# EAGLE design Master_G2553 (EAGLE 6.5.0)
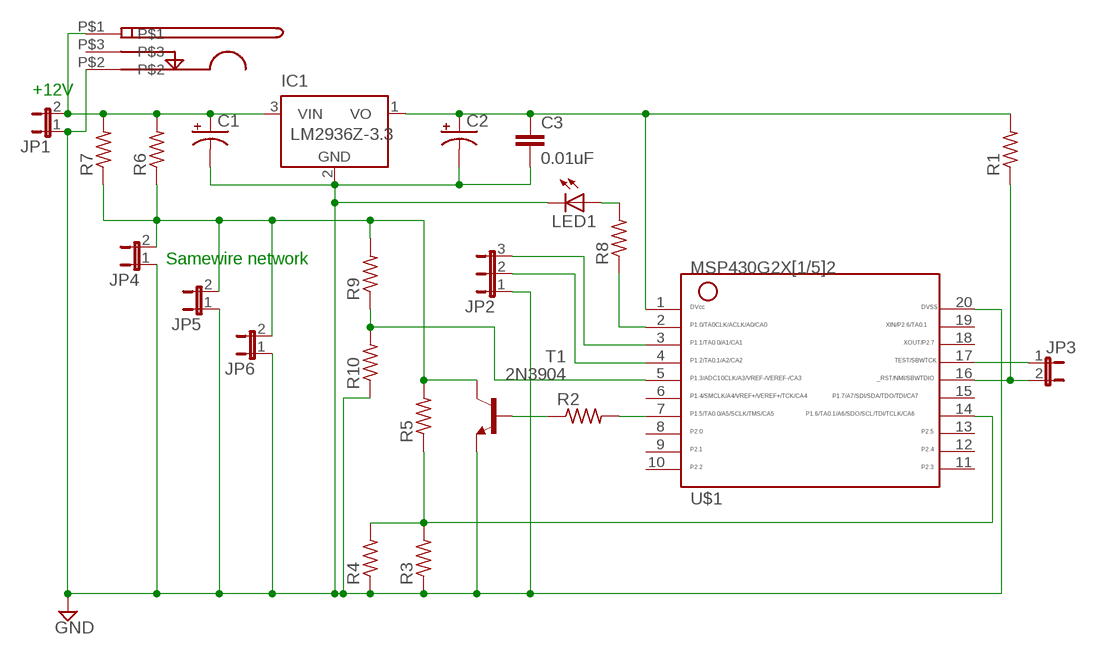
[diagram p0: schematic, sheet 1]

## Parts
C1  CPOL-USE2.5-6  [E2,5-6]
C2  CPOL-USE2.5-6  [E2,5-6]
C3  0.01uF  C7.5/3  [C7.5B3]
IC1  LM2936Z-3.3  [TO92]
JP1  JP1E  [JP1]
JP2  JP2E  [JP2]
JP3  JP1E  [JP1]
JP4  JP1E  [JP1]
JP5  JP1E  [JP1]
JP6  JP1E  [JP1]
LED1  LED3MM  [LED3MM]
R1  R-US_0204/2V  [0204V]
R2  R-US_0204/2V  [0204V]
R3  R-US_0204/2V  [0204V]
R4  R-US_0204/2V  [0204V]
R5  R-US_0204/2V  [0204V]
R6  R-US_0204/2V  [0204V]
R7  R-US_0204/2V  [0204V]
R8  R-US_0204/2V  [0204V]
R9  R-US_0204/2V  [0204V]
R10  R-US_0204/2V  [0204V]
T1  2N3904  [TO92]
U$1  G2X[1/5]2---N20  [N20]
U$2  2.1MM_5.5MM  [2.1MM_5.5MM]

## Nets
GND: C1.- C2.- C3.2 IC1.2(GND) JP1.1 JP2.1 JP4.1 JP5.1 JP6.1 LED1.K(C) R3.1 R4.1 R10.1 T1.3(E) U$1.20 U$2.P$2
N$1: JP2.2 U$1.4
N$2: R2.1 T1.2(B)
N$3 [pwr]: C1.+ IC1.3(VIN) JP1.2 R6.2 R7.2 U$2.P$1
N$4 [samewire]: JP4.2 JP5.2 JP6.2 R5.2 R6.1 R7.1 R9.2 T1.1(C)
N$5: R3.2 R4.2 R5.1 U$1.14
N$6: JP2.3 U$1.3
N$7: JP3.1 U$1.17
N$8: R2.2 U$1.7
N$9 [pwr]: C2.+ C3.1 IC1.1(VO) R1.2 U$1.1
N$10: LED1.A R8.2
N$11: R9.1 R10.2 U$1.5
N$12: R8.1 U$1.2
N$20: JP3.2 R1.1 U$1.16
Unconnected: U$1.6 U$1.8 U$1.9 U$1.10 U$1.11 U$1.12 U$1.13 U$1.15 U$1.18 U$1.19 U$2.P$3

## Notes on the sheet
- +12V
- Samewire network

## Library data of the parts
C1 C2 = rcl:CPOL-US: POLARIZED CAPACITOR, American symbol
C3 = capacitor-wima:C: CAPACITOR naming: grid - package width
IC1 = national-semiconductor:LM2936?*: Ultra-Low Quiescent Current LDO Voltage Regulator Source: Data sheet <http://www.national.com/ds/LM/LM2936.pdf>; MF: NATIONAL SEMICONDUCTOR; MPN: LM2936Z-3.3/NOPB; OC_FARNELL: 1564641; OC_NEWARK: 41K4532
JP1 JP3-JP6 = jumper:JP1E: JUMPER
JP2 = jumper:JP2E: JUMPER
LED1 = led:LED: LED OSRAM: - CHIPLED LG R971, LG N971, LY N971, LG Q971, LY Q971, LO R971, LY R971 LH N974, LH R974 LS Q976, LO Q976, LY Q976 LO Q996 - Hyper CHIPLED LW Q18S LB Q993, LB Q99A, LB R99A - SideLED LS A670, LO A670, LY A670, LG A670, LP A670 LB A673, LV A673, LT A673, LW A673 LH A674 LY A675 LS A676, LA A676, LO A676, LY A676, LW A676 LS A679, LY A679, LG A679 - Hyper Micro SIDELED® LS Y876, LA Y876, LO Y876, LY Y876 LT Y87S - SmartLED LW L88C, LW L88S LB L89C, LB L89S, LG L890 LS L89K, LO L89K, LY L89K LS L896, LA L896, LO L896, LY L896 - TOPLED LS T670, LO T670, LY T670, LG T670, LP T670 LSG T670, LSP T670, LSY T670, LOP T670, LYG T670 LG T671, LOG T671, LSG T671 LB T673, LV T673, LT T673, LW T673 LH T674 LS T676, LA T676, LO T676, LY T676, LB T676, LH T676, LSB T676, LW T676 LB T67C, LV T67C, LT T67C, LS T67K, LO T67K, LY T67K, LW E67C LS E67B, LA E67B, LO E67B, LY E67B, LB E67C, LV E67C, LT E67C LW T67C LS T679, LY T679, LG T679 LS T770, LO T770, LY T770, LG T770, LP T770 LB T773, LV T773, LT T773, LW T773 LH T774 LS E675, LA E675, LY E675, LS T675 LS T776, LA T776, LO T776, LY T776, LB T776 LHGB T686 LT T68C, LB T68C - Hyper Mini TOPLED® LB M676 - Mini TOPLED Santana® LG M470 LS M47K, LO M47K, LY M47K Source: http://www.osram.convergy.de LUXEON: - LUMILED® LXK2-PW12-R00, LXK2-PW12-S00, LXK2-PW14-U00, LXK2-PW14-V00 LXK2-PM12-R00, LXK2-PM12-S00, LXK2-PM14-U00 LXK2-PE12-Q00, LXK2-PE12-R00, LXK2-PE12-S00, LXK2-PE14-T00, LXK2-PE14-U00 LXK2-PB12-K00, LXK2-PB12-L00, LXK2-PB12-M00, LXK2-PB14-N00, LXK2-PB14-P00, LXK2-PB14-Q00 LXK2-PR12-L00, LXK2-PR12-M00, LXK2-PR14-Q00, LXK2-PR14-R00 LXK2-PD12-Q00, LXK2-PD12-R00, LXK2-PD12-S00 LXK2-PH12-R00, LXK2-PH12-S00 LXK2-PL12-P00, LXK2-PL12-Q00, LXK2-PL12-R00 Source: www.luxeon.com KINGBRIGHT: KA-3528ASYC Source: www.kingbright.com
R1-R10 = rcl:R-US_: RESISTOR, American symbol
T1 = transistor:2N3904: NPN TRANSISTOR
U$1 = TI_MSP430_v16:G2X[1/5]2---N20: MSP430G2X[1/5]2 MSP430G2x52, MSP430G2x12 PDIP (N) 20 Pin Package http://focus.ti.com/docs/prod/folders/print/msp430g2452.html
U$2 = CUI_PwrJack:2.1MM_5.5MM: CUI Connector Power Jack 2.1mm x 5.5mm

## Net classes
1 pwr: width 0.508 mm
2 samewire: width 0.508 mm

## Board
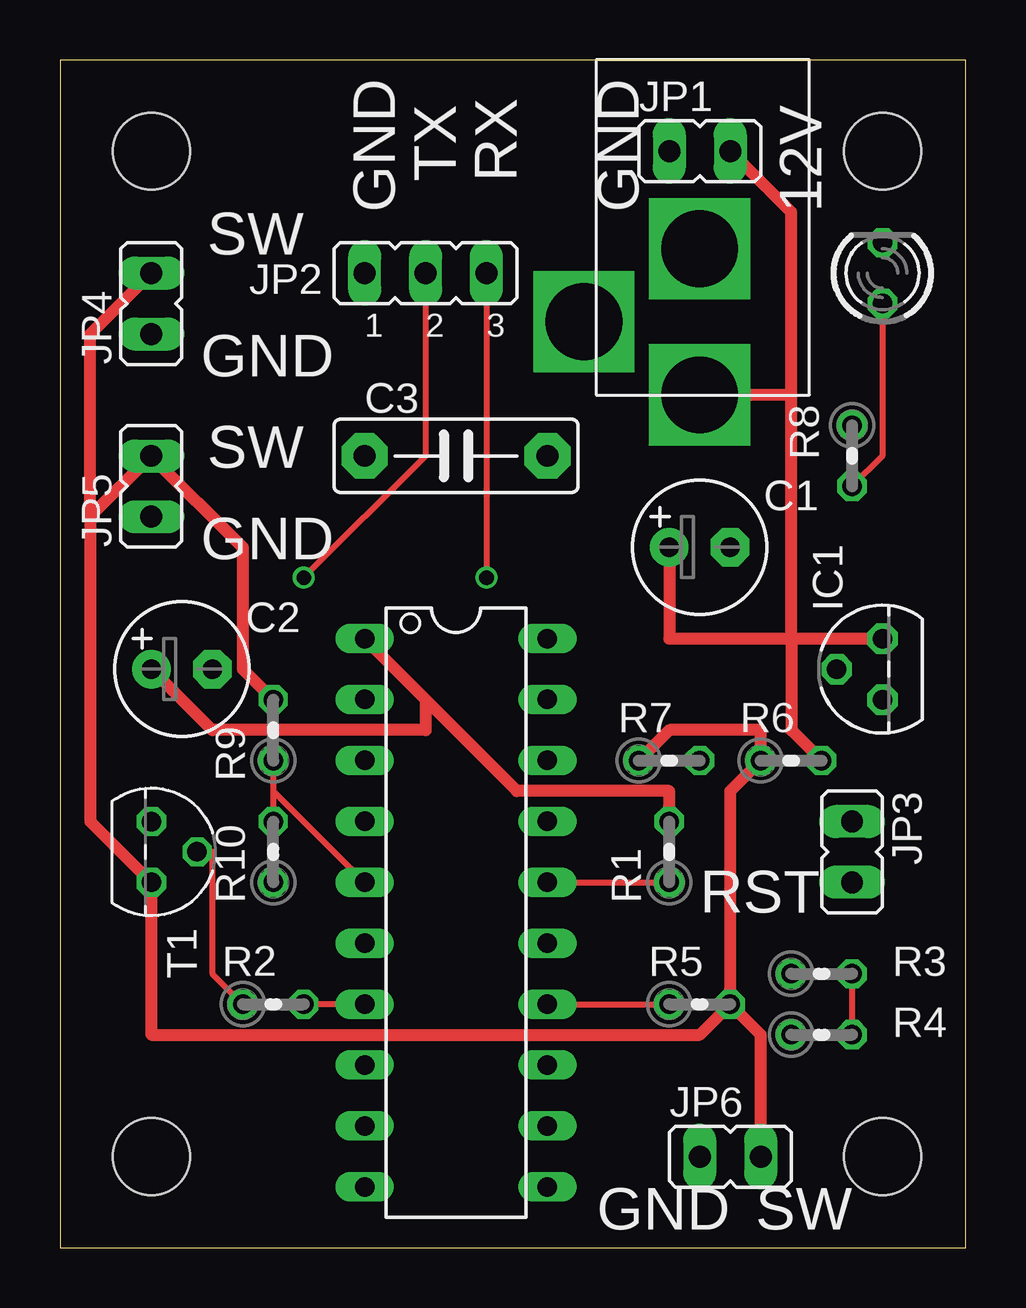
[diagram p1: board, top side]
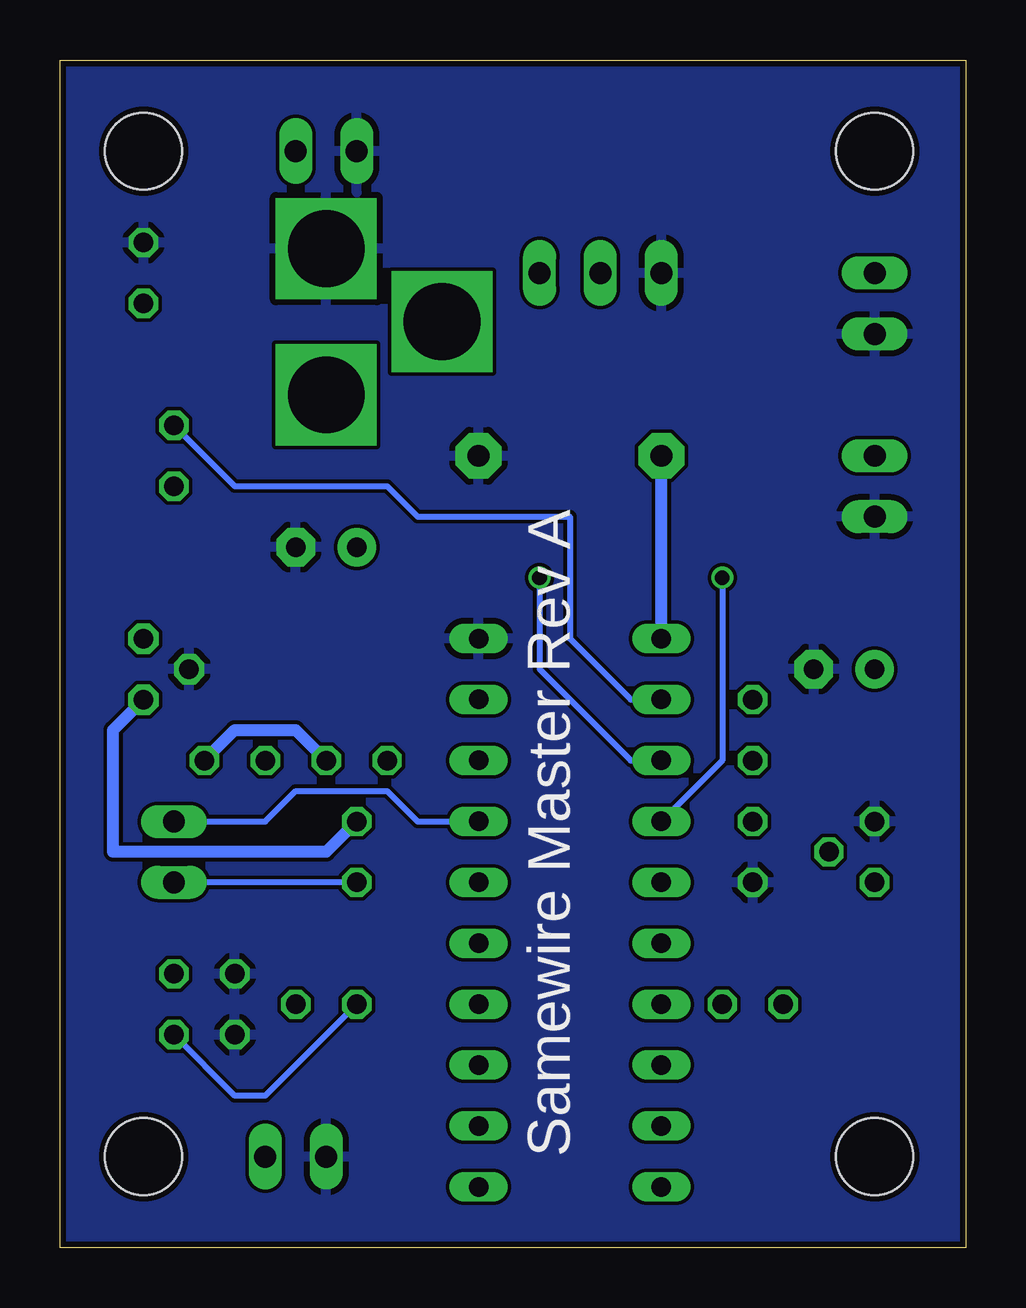
[diagram p2: board, bottom side, seen from below]

Size 37.77 x 49.52 mm. Coordinates in mm from the lower left corner, seen from the top.
Outline: 0,0 37.77,0 37.77,49.52 0,49.52 0,0
Copper layers (1*16): Top 0.035mm / dielectric 0.2mm / Bottom 0.035mm
Design rules "SeeedStudio_DRU_no_angle_20130527 *": minimum track width 6mil, minimum drill 12mil, track to track 6mil, track to pad 6mil, pad to pad 6mil, via to via 6mil, smd to smd 0mil, copper to edge 10mil, drill to drill 10mil, minimum pad ring 6mil, minimum via ring 6mil, stop-mask expansion 2mil, vias tented up to drill 25mil, thermal gap 10mil
Holes 3.2 mm at 34.29,45.72 3.81,45.72 34.29,3.81 3.81,3.81

### Footprints (pad centres in the part's own frame; a part is rotated, then mirrored left to right if it is on the bottom)
E2,5-6 = drill 0.813 pad 1.6: + -1.27,0 | drill 0.813 pad 1.6 octagon: - 1.27,0
C7.5B3 = drill 0.914 pad 1.905 octagon: 1 -3.81,0; 2 3.81,0
TO92 = drill 0.813 pad 1.27 octagon: 1 -1.27,0; 2 0,1.905; 3 1.27,0
JP1 = drill 0.914 long: 1 0,-1.27; 2 0,1.27
JP2 = drill 0.914 long: 1 -2.54,0; 2 0,0; 3 2.54,0
LED3MM = drill 0.813 octagon: A -1.27,0; K 1.27,0
0204V = drill 0.813 octagon: 1 -1.27,0; 2 1.27,0
TO92' = drill 0.813 octagon: 1 1.27,0; 2 0,1.905; 3 -1.27,0
N20 = drill 0.813 long: 1 -11.435,-3.81; 2 -8.895,-3.81; 3 -6.355,-3.81; 4 -3.815,-3.81; 5 -1.275,-3.81; 6 1.265,-3.81; 7 3.805,-3.81; 8 6.345,-3.81; 9 8.885,-3.81; 10 11.425,-3.81; 11 11.425,3.81; 12 8.885,3.81; 13 6.345,3.81; 14 3.805,3.81; 15 1.265,3.81; 16 -1.275,3.81; 17 -3.815,3.81; 18 -6.355,3.81; 19 -8.895,3.81; 20 -11.435,3.81
2.1MM_5.5MM = drill 3.2 square: P$1 0,0; P$2 0,-6.096; P$3 4.826,-3.048

### Placement (x,y rotation side)
C1  26.67,29.21 0 top
C2  5.08,24.13 0 top
C3  16.51,33.02 0 top
IC1  34.29,24.13 90 top
JP1  26.67,45.72 270 top
JP2  15.24,40.64 0 top
JP3  33.02,16.51 180 top
JP4  3.81,39.37 0 top
JP5  3.81,31.75 0 top
JP6  27.94,3.81 270 top
LED1  34.29,40.64 90 top
R1  25.4,16.51 90 top
R2  8.89,10.16 0 top
R3  31.75,11.43 0 top
R4  31.75,8.89 0 top
R5  26.67,10.16 0 top
R6  30.48,20.32 0 top
R7  25.4,20.32 0 top
R8  33.02,33.02 270 top
R9  8.89,21.59 90 top
R10  8.89,16.51 90 top
T1  2N3904  [TO92']  3.81,16.51 270 top
U$1  16.51,13.97 270 top
U$2  26.67,35.56 180 top

### Tracks (layer width: path | path; a pad name or v marks a point on that pad's centre or on a via)
GND
  pour Bottom: 0,49.53 0,0 38.1,0 38.1,49.53
N$1  (via drill 0.61)
  Top 0.254: v10.16,27.94 15.24,33.02 JP2.2
  Bottom 0.254: v10.16,27.94 10.16,20.32 U$1.4
N$2
  Top 0.254: R2.1 6.35,11.43 6.35,16.51 T1.2
N$3
  Top 0.508: 30.48,25.4 25.4,25.4 C1.+ | 30.48,25.4 IC1.3 | JP1.2 30.48,43.18 30.48,35.56 | 30.48,25.4 30.48,35.56 | R6.2 30.48,21.59 30.48,25.4 | 30.48,35.56 U$2.P$1
  Bottom 0.508: R7.2 27.94,21.59 30.48,21.59 R6.2
N$4
  Top 0.508: R7.1 25.4,21.59 29.21,21.59 R6.1 27.94,19.05 R5.2 | R5.2 29.21,8.89 JP6.2 | 1.27,30.48 1.27,17.78 T1.1 3.81,8.89 26.67,8.89 R5.2 | 1.27,30.48 JP5.2 7.62,29.21 7.62,24.13 R9.2 | JP4.2 1.27,38.1 1.27,30.48
N$5
  Top 0.254: R3.2 R4.2 | R5.1 U$1.14
  Bottom 0.254: R4.2 30.48,6.35 29.21,6.35 R5.1
N$6  (via drill 0.61)
  Top 0.254: JP2.3 v17.78,27.94
  Bottom 0.254: v17.78,27.94 17.78,24.13 13.97,20.32 U$1.3
N$7
  Bottom 0.254: JP3.1 29.21,17.78 27.94,19.05 24.13,19.05 22.86,17.78 U$1.17
N$8
  Top 0.254: R2.2 U$1.7
N$9
  Top 0.508: 15.24,22.86 19.05,19.05 25.4,19.05 R1.2 | 15.24,22.86 U$1.1 | C2.+ 6.35,21.59 15.24,21.59 15.24,22.86
  Bottom 0.508: IC1.1 35.56,21.59 35.56,16.51 26.67,16.51 R1.2 | C3.1 U$1.1
N$10
  Top 0.254: R8.2 34.29,33.02 LED1.A
N$11
  Top 0.254: R9.1 8.89,19.05 | 8.89,19.05 R10.2 | 8.89,19.05 U$1.5
N$12
  Bottom 0.254: R8.1 30.48,31.75 24.13,31.75 22.86,30.48 16.51,30.48 16.51,25.4 13.97,22.86 U$1.2
N$20
  Top 0.254: R1.1 U$1.16
  Bottom 0.254: R1.1 JP3.2

### Text on the board
tPlace: TX | RX | SW | GND | GND | 12V | GND | SW | GND | RST | GND | SW
bPlace: Samewire Master Rev A